# Altium schematic sheet test1.SchDoc
size A4
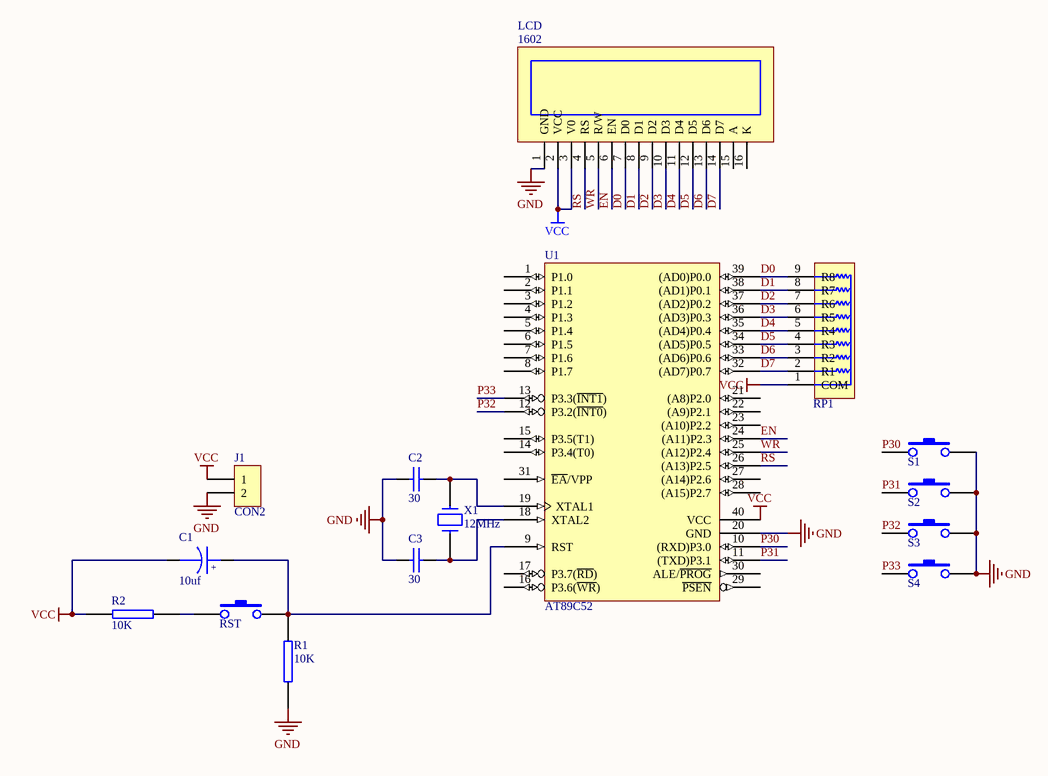
[diagram p0: test1.SchDoc]

## Parts
C1  10uf  [C_SMT-5*5]
C2  30  [C0805]
C3  30  [C0805]
J1  CON2  [TC2]
LCD  1602  [LCD1602]
R1  10K  [C0805]
R2  10K  [C0805]
RP1  103  [R-9PIN]  (value not drawn)
RST  SW-PB  [ANJIAN]  (value not drawn)
S1  SW-PB  [ANJIAN]  (value not drawn)
S2  SW-PB  [ANJIAN]  (value not drawn)
S3  SW-PB  [ANJIAN]  (value not drawn)
S4  SW-PB  [ANJIAN]  (value not drawn)
U1  AT89C52  [JINSUOZUO]
X1  12MHz  [XTAL1]

## Nets
GND: C2.2 C3.2 J1.2 LCD.1(GND) R1.2 S1.2 S2.2 S3.2 S4.2 U1.20(GND)
VCC: C1.1 J1.1 LCD.2(VCC) LCD.3(V0) R2.1 RP1.1(COM) U1.40(VCC)
D0: LCD.7(D0) RP1.9(R8) U1.39((AD0)P0.0)
D1: LCD.8(D1) RP1.8(R7) U1.38((AD1)P0.1)
D2: LCD.9(D2) RP1.7(R6) U1.37((AD2)P0.2)
D3: LCD.10(D3) RP1.6(R5) U1.36((AD3)P0.3)
D4: LCD.11(D4) RP1.5(R4) U1.35((AD4)P0.4)
D5: LCD.12(D5) RP1.4(R3) U1.34((AD5)P0.5)
D6: LCD.13(D6) RP1.3(R2) U1.33((AD6)P0.6)
D7: LCD.14(D7) RP1.2(R1) U1.32((AD7)P0.7)
EN: LCD.6(EN) U1.24((A11)P2.3)
P30: S1.1 U1.10((RXD)P3.0)
P31: S2.1 U1.11((TXD)P3.1)
P32: S3.1 U1.12(P3.2(~{INT0}))
P33: S4.1 U1.13(P3.3(~{INT1}))
RS: LCD.4(RS) U1.26((A13)P2.5)
WR: LCD.5(R/W) U1.25((A12)P2.4)
NetC1_2: C1.2 R1.1 RST.2 U1.9(RST)
NetC2_1: C2.1 U1.19(XTAL1) X1.1
NetC3_1: C3.1 U1.18(XTAL2) X1.2
NetR2_2: R2.2 RST.1

Not connected (* = marked no-connect by the designer): LCD 15(A) 16(K); U1 1(P1.0) 2(P1.1) 3(P1.2) 4(P1.3) 5(P1.4) 6(P1.5) 7(P1.6) 8(P1.7) 14(P3.4(T0)) 15(P3.5(T1)) 16(P3.6(~{WR})) 17(P3.7(~{RD})) 21((A8)P2.0) 22((A9)P2.1) 23((A10)P2.2) 27((A14)P2.6) 28((A15)P2.7) 29(~{PSEN}) 30(ALE/~{PROG}) 31(~{EA}/VPP)

## Notes on the sheet
- (in symbol 电解电容) +

## Library data of the parts
C1 = 电解电容: Capacitor
C2 C3 = CAP: Capacitor
J1 = CON2: Connector
LCD = LCM1602
R1 R2 = RES2
RP1 = RP8
U1 = AT89C51: 8-Bit Microcontroller with 4K Flash ROM
X1 = CRYSTAL